# Altium schematic sheet Blocks.SchDoc
size A
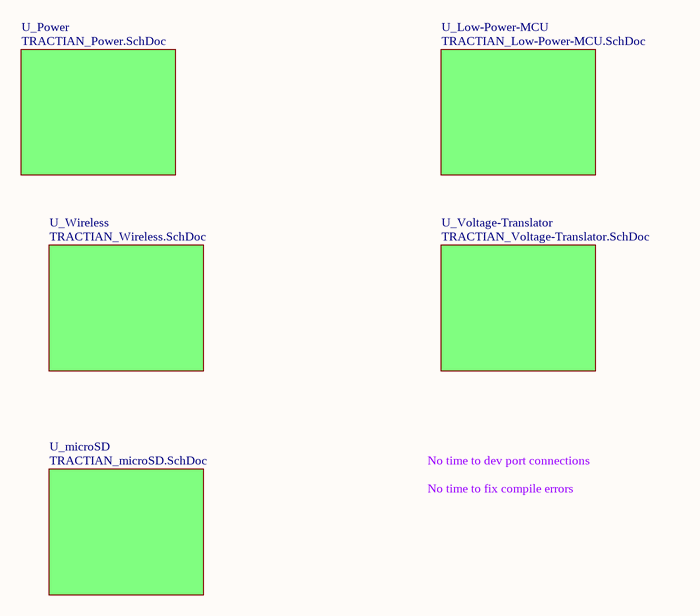
[diagram p0: Blocks.SchDoc]

## Sub-sheets
U_Low-Power-MCU = TRACTIAN_Low-Power-MCU.SchDoc: no entries
U_microSD = TRACTIAN_microSD.SchDoc: no entries
U_Power = TRACTIAN_Power.SchDoc: no entries
U_Voltage-Translator = TRACTIAN_Voltage-Translator.SchDoc: no entries
U_Wireless = TRACTIAN_Wireless.SchDoc: no entries

## Notes on the sheet
- No time to dev port connections
- No time to fix compile errors